# EAGLE schematic shift-register (EAGLE 7.6.0)
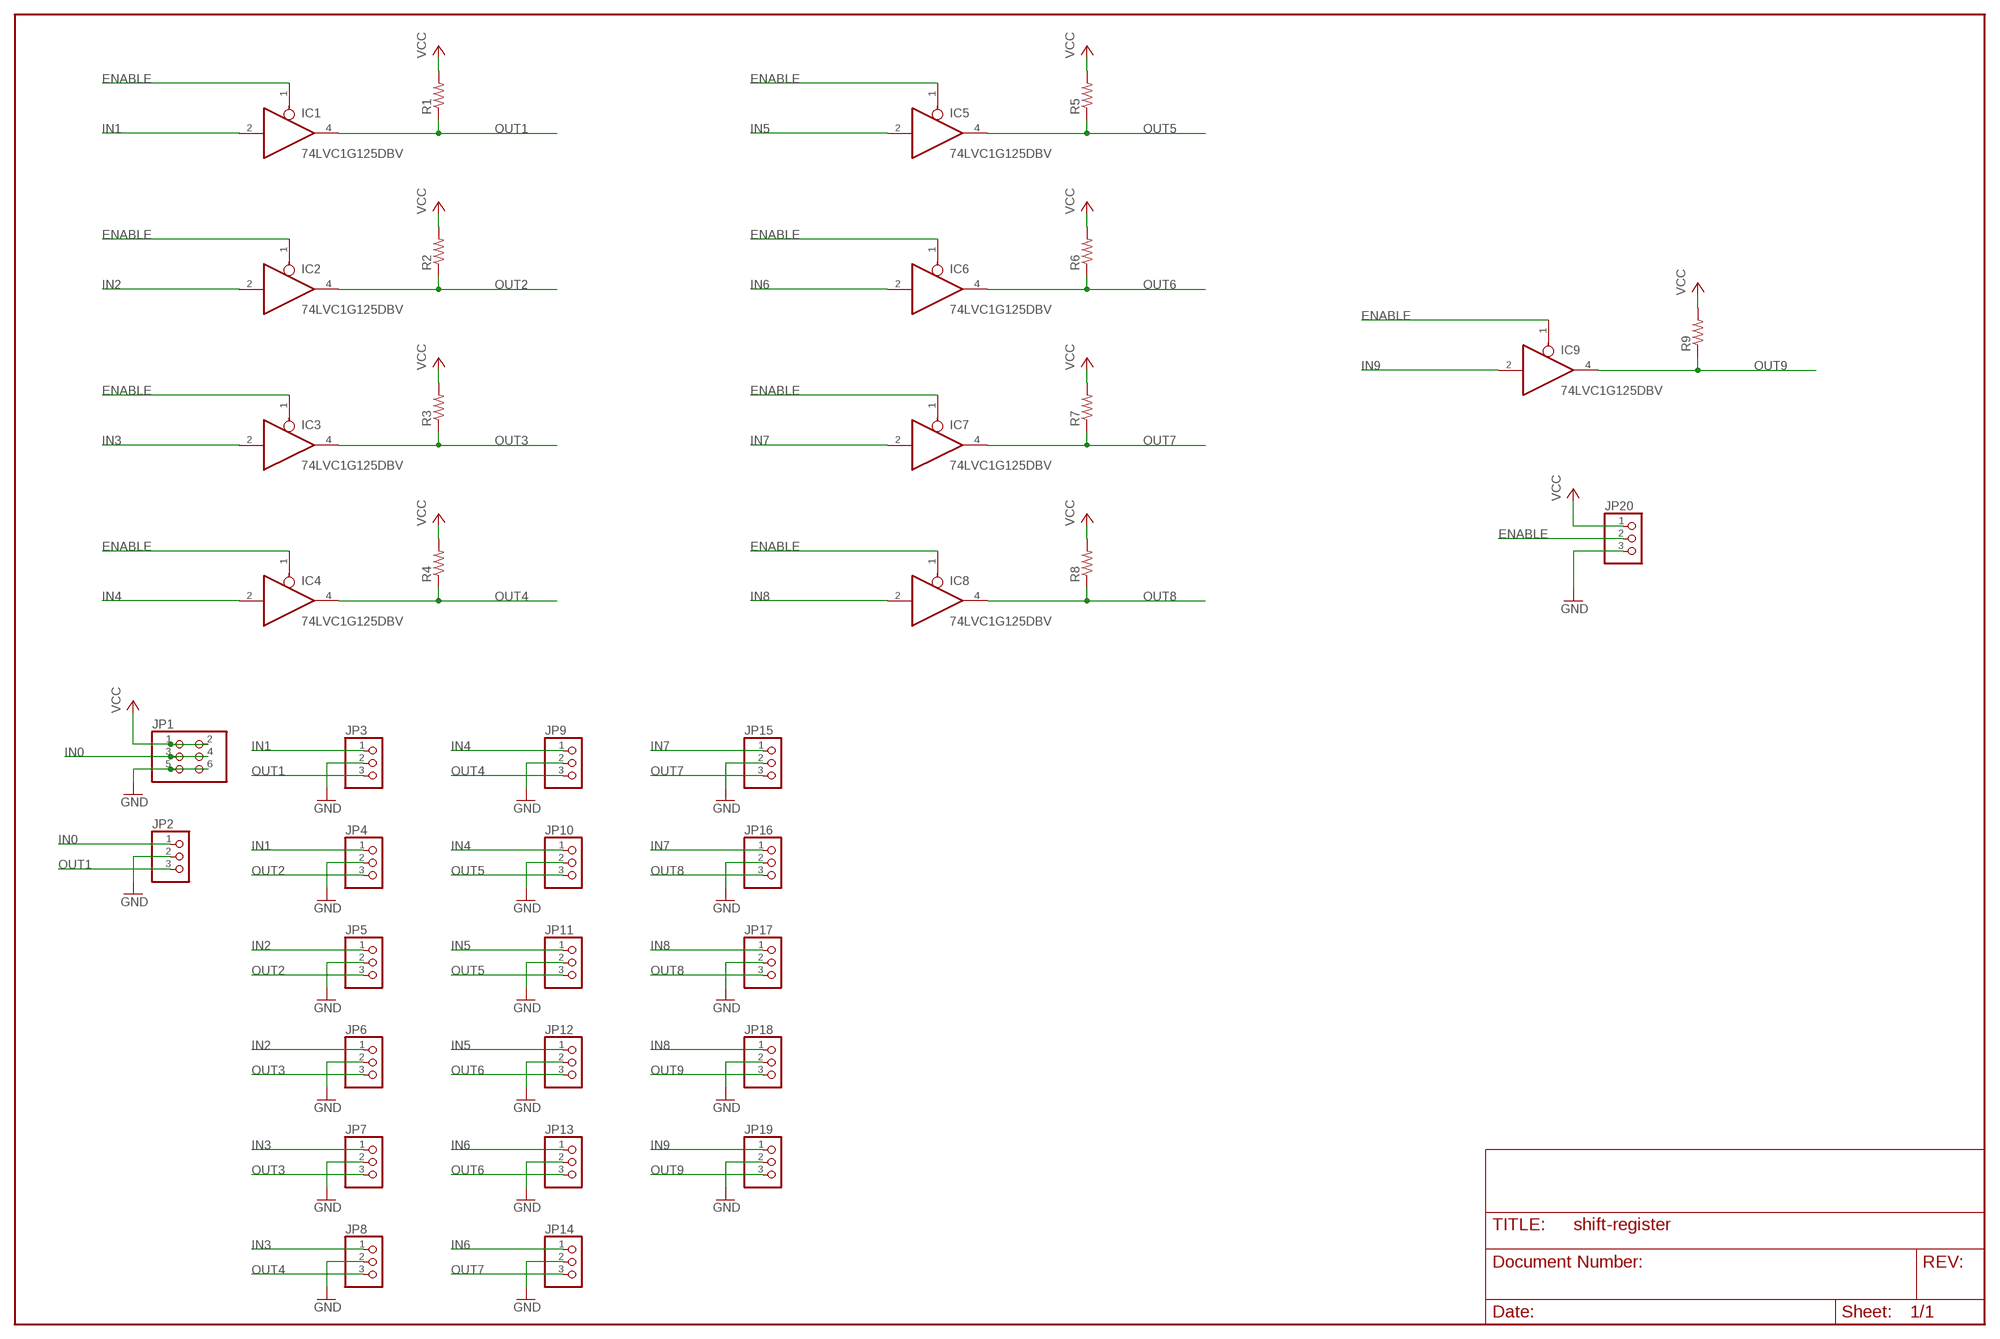
[diagram p0: schematic, sheet 1]

## Parts
IC1  74LVC1G125DBV  [SOT23-5]
IC2  74LVC1G125DBV  [SOT23-5]
IC3  74LVC1G125DBV  [SOT23-5]
IC4  74LVC1G125DBV  [SOT23-5]
IC5  74LVC1G125DBV  [SOT23-5]
IC6  74LVC1G125DBV  [SOT23-5]
IC7  74LVC1G125DBV  [SOT23-5]
IC8  74LVC1G125DBV  [SOT23-5]
IC9  74LVC1G125DBV  [SOT23-5]
JP1  PINHD-2X3  [2X03]
JP2  PINHD-1X3  [1X03]
JP3  PINHD-1X3  [1X03]
JP4  PINHD-1X3  [1X03]
JP5  PINHD-1X3  [1X03]
JP6  PINHD-1X3  [1X03]
JP7  PINHD-1X3  [1X03]
JP8  PINHD-1X3  [1X03]
JP9  PINHD-1X3  [1X03]
JP10  PINHD-1X3  [1X03]
JP11  PINHD-1X3  [1X03]
JP12  PINHD-1X3  [1X03]
JP13  PINHD-1X3  [1X03]
JP14  PINHD-1X3  [1X03]
JP15  PINHD-1X3  [1X03]
JP16  PINHD-1X3  [1X03]
JP17  PINHD-1X3  [1X03]
JP18  PINHD-1X3  [1X03]
JP19  PINHD-1X3  [1X03]
JP20  PINHD-1X3  [1X03]
R1  R-US_R0603  [R0603]
R2  R-US_R0603  [R0603]
R3  R-US_R0603  [R0603]
R4  R-US_R0603  [R0603]
R5  R-US_R0603  [R0603]
R6  R-US_R0603  [R0603]
R7  R-US_R0603  [R0603]
R8  R-US_R0603  [R0603]
R9  R-US_R0603  [R0603]

## Nets
ENABLE: IC1.1(OE) IC2.1(OE) IC3.1(OE) IC4.1(OE) IC5.1(OE) IC6.1(OE) IC7.1(OE) IC8.1(OE) IC9.1(OE) JP20.2
GND: JP1.5 JP1.6 JP2.2 JP3.2 JP4.2 JP5.2 JP6.2 JP7.2 JP8.2 JP9.2 JP10.2 JP11.2 JP12.2 JP13.2 JP14.2 JP15.2 JP16.2 JP17.2 JP18.2 JP19.2 JP20.3
IN0: JP1.3 JP1.4 JP2.1
IN1: IC1.2(I) JP3.1 JP4.1
IN2: IC2.2(I) JP5.1 JP6.1
IN3: IC3.2(I) JP7.1 JP8.1
IN4: IC4.2(I) JP9.1 JP10.1
IN5: IC5.2(I) JP11.1 JP12.1
IN6: IC6.2(I) JP13.1 JP14.1
IN7: IC7.2(I) JP15.1 JP16.1
IN8: IC8.2(I) JP17.1 JP18.1
IN9: IC9.2(I) JP19.1
OUT1: IC1.4(O) JP2.3 JP3.3 R1.1
OUT2: IC2.4(O) JP4.3 JP5.3 R2.1
OUT3: IC3.4(O) JP6.3 JP7.3 R3.1
OUT4: IC4.4(O) JP8.3 JP9.3 R4.1
OUT5: IC5.4(O) JP10.3 JP11.3 R5.1
OUT6: IC6.4(O) JP12.3 JP13.3 R6.1
OUT7: IC7.4(O) JP14.3 JP15.3 R7.1
OUT8: IC8.4(O) JP16.3 JP17.3 R8.1
OUT9: IC9.4(O) JP18.3 JP19.3 R9.1
VCC: JP1.1 JP1.2 JP20.1 R1.2 R2.2 R3.2 R4.2 R5.2 R6.2 R7.2 R8.2 R9.2

## Power pins joined to a net without a drawn wire
GND: IC1.3(GND) IC2.3(GND) IC3.3(GND) IC4.3(GND) IC5.3(GND) IC6.3(GND) IC7.3(GND) IC8.3(GND) IC9.3(GND)
VCC: IC1.5(VCC) IC2.5(VCC) IC3.5(VCC) IC4.5(VCC) IC5.5(VCC) IC6.5(VCC) IC7.5(VCC) IC8.5(VCC) IC9.5(VCC)

## Library data of the parts
IC1-IC9 = 74xx-little-us:74*1G125: Single Bus Buffer Gate with 3-State Output
JP1 = pinhead:PINHD-2X3: PIN HEADER
JP2-JP20 = pinhead:PINHD-1X3: PIN HEADER
R1-R9 = resistor:R-US_: RESISTOR, American symbol